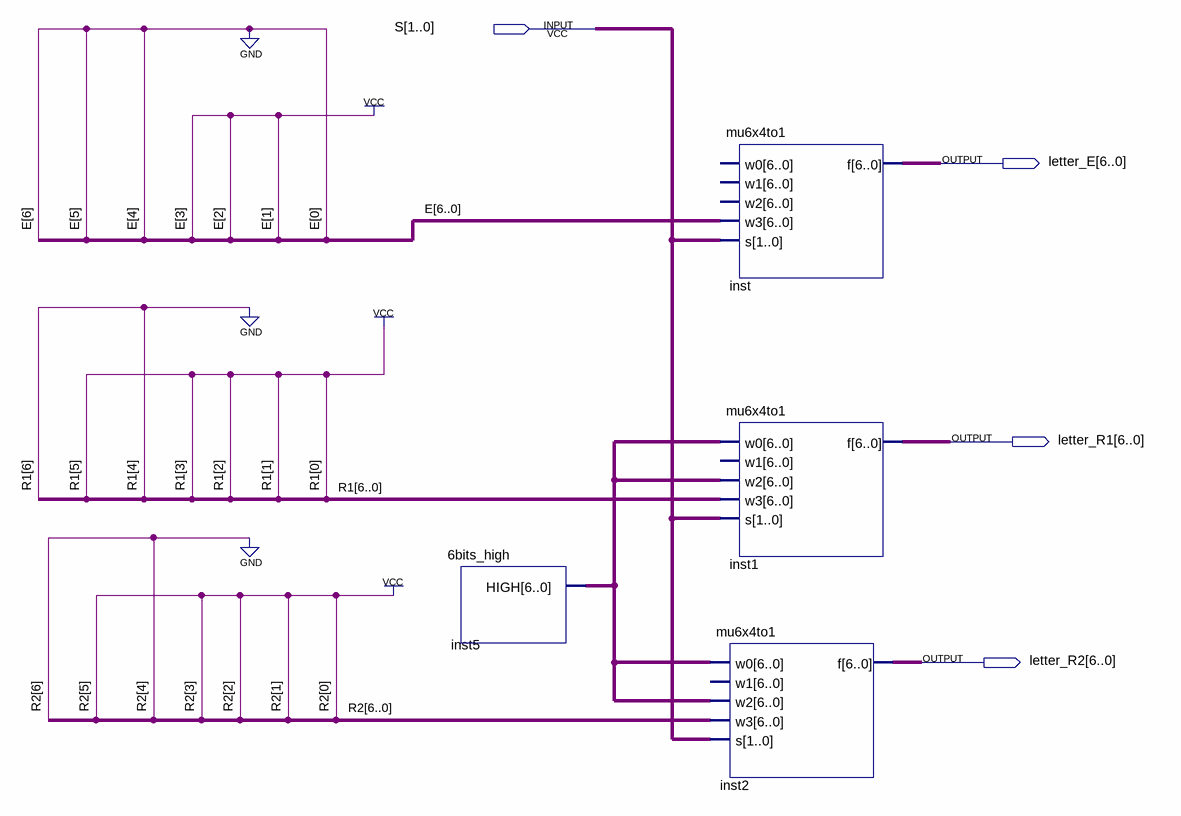
[diagram p0: schematic sheet]
// Quartus schematic error_output.bdf as structural Verilog: 4 symbols, 4 pins
module error_output (
  input  [1:0] S,
  output [6:0] letter_E,
  output [6:0] letter_R1,
  output [6:0] letter_R2
);

  wire [6:0] inst5_high;

  \6bits_high  inst5 (.HIGH(inst5_high));
  mu6x4to1 inst (.w3(7'b0001110), .s(S), .f(letter_E));  // open: w0, w1, w2
  mu6x4to1 inst1 (.w0(inst5_high), .w2(inst5_high), .w3(7'b0101111), .s(S), .f(letter_R1));  // open: w1
  mu6x4to1 inst2 (.w0(inst5_high), .w2(inst5_high), .w3(7'b0101111), .s(S), .f(letter_R2));  // open: w1
endmodule
